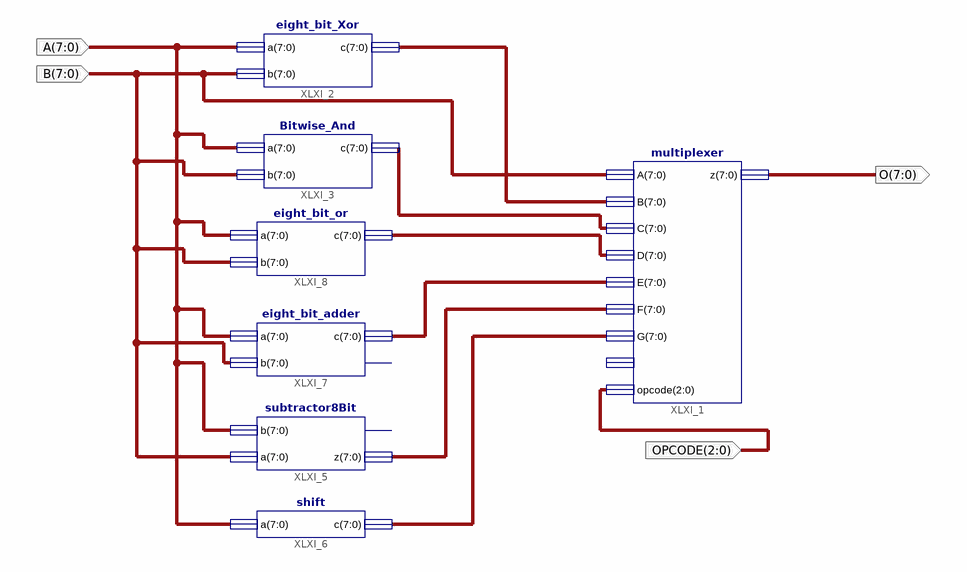
[diagram p0: schematic sheet 1]
// Xilinx ISE schematic ALU.sch (spartan6) as structural Verilog: 7 symbols, 4 ports
module ALU (
  input  [7:0] A,
  input  [2:0] OPCODE,
  input  [7:0] B,
  output [7:0] O
);

  wire [7:0] XLXN_1, XLXN_9, XLXN_19, XLXN_35, XLXN_37, XLXN_54;

  eight_bit_Xor XLXI_2 (.a(A), .b(B), .c(XLXN_1));
  Bitwise_And XLXI_3 (.a(A), .b(B), .c(XLXN_9));
  subtractor8Bit XLXI_5 (.b(A), .a(B), .z(XLXN_35));  // open: carryout
  shift XLXI_6 (.a(A), .c(XLXN_37));
  eight_bit_adder XLXI_7 (.a(A), .b(B), .c(XLXN_54));  // open: CarryOut
  multiplexer XLXI_1 (
    .A(B), .B(XLXN_1), .C(XLXN_9), .D(XLXN_19), .E(XLXN_54), .F(XLXN_35), .G(XLXN_37), .opcode(OPCODE), .z(O));  // open: H
  eight_bit_or XLXI_8 (.a(A), .b(B), .c(XLXN_19));
endmodule
